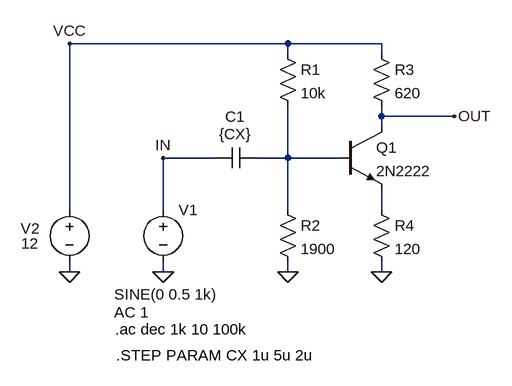
[diagram p0: schematic Transistor_Amplifier.asc]
Transistor_Amplifier.asc, the LTspice schematic file:
Version 4
SHEET 1 2032 680
WIRE -144 64 -480 64
WIRE 0 64 -144 64
WIRE -144 80 -144 64
WIRE 0 80 0 64
WIRE 0 176 0 160
WIRE 112 176 0 176
WIRE 0 192 0 176
WIRE -256 240 -336 240
WIRE -144 240 -144 160
WIRE -144 240 -192 240
WIRE -64 240 -144 240
WIRE -480 320 -480 64
WIRE -336 320 -336 240
WIRE -144 320 -144 240
WIRE 0 320 0 288
WIRE -480 416 -480 400
WIRE -336 416 -336 400
WIRE -144 416 -144 400
WIRE 0 416 0 400
FLAG 0 416 0
FLAG -144 416 0
FLAG -336 416 0
FLAG -480 416 0
FLAG -336 240 IN
FLAG 112 176 OUT
FLAG -480 64 VCC
SYMBOL res -160 64 R0
SYMATTR InstName R1
SYMATTR Value 10k
SYMBOL res -160 304 R0
SYMATTR InstName R2
SYMATTR Value 1900
SYMBOL res -16 64 R0
SYMATTR InstName R3
SYMATTR Value 620
SYMBOL res -16 304 R0
SYMATTR InstName R4
SYMATTR Value 120
SYMBOL npn -64 192 R0
SYMATTR InstName Q1
SYMATTR Value 2N2222
SYMBOL cap -192 224 R90
WINDOW 0 -32 33 VBottom 2
WINDOW 3 -36 33 VTop 2
SYMATTR InstName C1
SYMATTR Value {CX}
SYMBOL voltage -336 304 R0
WINDOW 3 -75 146 Left 2
WINDOW 123 -75 174 Left 2
WINDOW 39 0 0 Left 0
SYMATTR InstName V1
SYMATTR Value SINE(0 0.5 1k)
SYMATTR Value2 AC 1
SYMBOL voltage -480 304 R0
WINDOW 0 -75 45 Left 2
WINDOW 3 -74 68 Left 2
WINDOW 123 0 0 Left 0
WINDOW 39 0 0 Left 0
SYMATTR InstName V2
SYMATTR Value 12
TEXT -410 504 Left 2 !.ac dec 1k 10 100k
TEXT -408 544 Left 2 !.STEP PARAM CX 1u 5u 2u

The netlist it stands for:
* Transistor_Amplifier.asc
R1 VCC N001 10k
R2 N001 0 1900
R3 VCC OUT 620
R4 N002 0 120
Q1 OUT N001 N002 0 2N2222
C1 N001 IN {CX}
V1 IN 0 SINE(0 0.5 1k) AC 1
V2 VCC 0 12
.model NPN NPN
.model PNP PNP
.lib standard.bjt
.ac dec 1k 10 100k
.STEP PARAM CX 1u 5u 2u
.backanno
.end